# EAGLE design ARE_adaptadora_PIC_8-14pin (EAGLE 6.5.0)
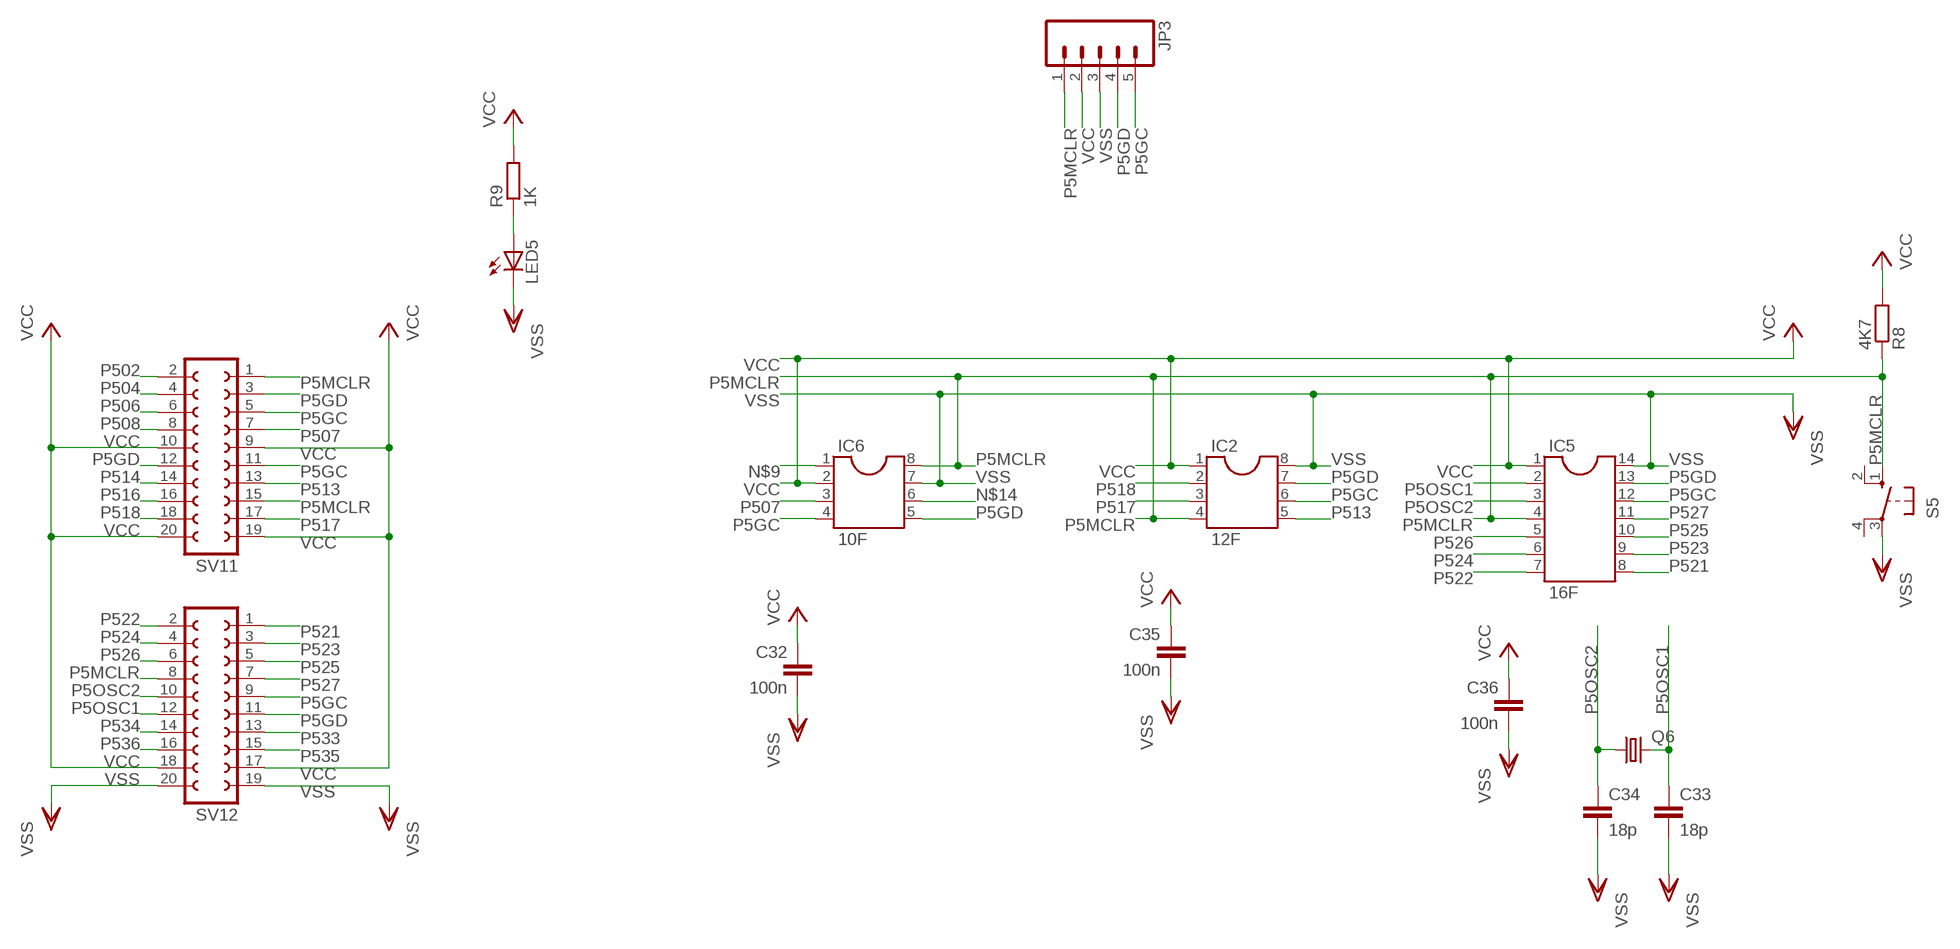
[diagram p0: schematic, sheet 1]

## Parts
C32  100n  C-EUC0805  [C0805]
C33  18p  C-EUC0805  [C0805]
C34  18p  C-EUC0805  [C0805]
C35  100n  C-EUC0805  [C0805]
C36  100n  C-EUC0805  [C0805]
IC2  12F  DIL8S  [SOCKET-08]
IC5  16F  DIL14S  [SOCKET-14]
IC6  10F  DIL8S  [SOCKET-08]
JP3  M05PTH  [1X05]
LED5  LEDCHIPLED_0805  [CHIPLED_0805]
Q6  CRYSTALHC18U-V  [HC18U-V]
R8  4K7  R-EU_R0805  [R0805]
R9  1K  R-EU_R0805  [R0805]
S5  10-XX  [B3F-10XX]
SV11  FE10-2W  [FE10-2W]
SV12  FE10-2W  [FE10-2W]

## Nets
N$8: LED5.A R9.1
N$9: IC6.1
N$14: IC6.6
P5GC: IC2.6 IC5.12 IC6.4 JP3.5 SV11.5 SV11.11 SV12.9
P5GD: IC2.7 IC5.13 IC6.5 JP3.4 SV11.3 SV11.12 SV12.11
P5MCLR: IC2.4 IC5.4 IC6.8 JP3.1 R8.1 S5.1(S) SV11.1 SV11.15 SV12.8
P5OSC1: C33.1 IC5.2 Q6.2 SV12.12
P5OSC2: C34.1 IC5.3 Q6.1 SV12.10
P502: SV11.2
P504: SV11.4
P506: SV11.6
P507: IC6.3 SV11.7
P508: SV11.8
P513: IC2.5 SV11.13
P514: SV11.14
P516: SV11.16
P517: IC2.3 SV11.17
P518: IC2.2 SV11.18
P521: IC5.8 SV12.1
P522: IC5.7 SV12.2
P523: IC5.9 SV12.3
P524: IC5.6 SV12.4
P525: IC5.10 SV12.5
P526: IC5.5 SV12.6
P527: IC5.11 SV12.7
P533: SV12.13
P534: SV12.14
P535: SV12.15
P536: SV12.16
VCC: C32.1 C35.1 C36.1 IC2.1 IC5.1 IC6.2 JP3.2 R8.2 R9.2 SV11.9 SV11.10 SV11.19 SV11.20 SV12.17 SV12.18
VSS: C32.2 C33.2 C34.2 C35.2 C36.2 IC2.8 IC5.14 IC6.7 JP3.3 LED5.C S5.3(P) SV12.19 SV12.20
Unconnected: S5.2(S1) S5.4(P1)

## Library data of the parts
C32-C36 = rcl:C-EU: CAPACITOR, European symbol
IC2 IC6 = ic-package:DIL8: Dual In Line / Socket
IC5 = ic-package:DIL14: Dual In Line / Socket
JP3 = SparkFun:M05: Header 5 Standard 5-pin 0.1" header. Use with straight break away headers (SKU : PRT-00116), right angle break away headers (PRT-00553), swiss pins (PRT-00743), machine pins (PRT-00117), and female headers (PRT-00115). Molex polarized connector foot print use with SKU : PRT-08230 with associated crimp pins and housings.
LED5 = led:LED: LED OSRAM: - CHIPLED LG R971, LG N971, LY N971, LG Q971, LY Q971, LO R971, LY R971 LH N974, LH R974 LS Q976, LO Q976, LY Q976 LO Q996 - Hyper CHIPLED LW Q18S LB Q993, LB Q99A, LB R99A - SideLED LS A670, LO A670, LY A670, LG A670, LP A670 LB A673, LV A673, LT A673, LW A673 LH A674 LY A675 LS A676, LA A676, LO A676, LY A676, LW A676 LS A679, LY A679, LG A679 - Hyper Micro SIDELED® LS Y876, LA Y876, LO Y876, LY Y876 LT Y87S - SmartLED LW L88C, LW L88S LB L89C, LB L89S, LG L890 LS L89K, LO L89K, LY L89K LS L896, LA L896, LO L896, LY L896 - TOPLED LS T670, LO T670, LY T670, LG T670, LP T670 LSG T670, LSP T670, LSY T670, LOP T670, LYG T670 LG T671, LOG T671, LSG T671 LB T673, LV T673, LT T673, LW T673 LH T674 LS T676, LA T676, LO T676, LY T676, LB T676, LH T676, LSB T676, LW T676 LB T67C, LV T67C, LT T67C, LS T67K, LO T67K, LY T67K, LW E67C LS E67B, LA E67B, LO E67B, LY E67B, LB E67C, LV E67C, LT E67C LW T67C LS T679, LY T679, LG T679 LS T770, LO T770, LY T770, LG T770, LP T770 LB T773, LV T773, LT T773, LW T773 LH T774 LS E675, LA E675, LY E675, LS T675 LS T776, LA T776, LO T776, LY T776, LB T776 LHGB T686 LT T68C, LB T68C - Hyper Mini TOPLED® LB M676 - Mini TOPLED Santana® LG M470 LS M47K, LO M47K, LY M47K Source: http://www.osram.convergy.de LUXEON: - LUMILED® LXK2-PW12-R00, LXK2-PW12-S00, LXK2-PW14-U00, LXK2-PW14-V00 LXK2-PM12-R00, LXK2-PM12-S00, LXK2-PM14-U00 LXK2-PE12-Q00, LXK2-PE12-R00, LXK2-PE12-S00, LXK2-PE14-T00, LXK2-PE14-U00 LXK2-PB12-K00, LXK2-PB12-L00, LXK2-PB12-M00, LXK2-PB14-N00, LXK2-PB14-P00, LXK2-PB14-Q00 LXK2-PR12-L00, LXK2-PR12-M00, LXK2-PR14-Q00, LXK2-PR14-R00 LXK2-PD12-Q00, LXK2-PD12-R00, LXK2-PD12-S00 LXK2-PH12-R00, LXK2-PH12-S00 LXK2-PL12-P00, LXK2-PL12-Q00, LXK2-PL12-R00 Source: www.luxeon.com KINGBRIGHT: KA-3528ASYC Source: www.kingbright.com
Q6 = crystal:CRYSTAL: CRYSTAL; OC_FARNELL: unknown; OC_NEWARK: unknown
R8 R9 = rcl:R-EU_: RESISTOR, European symbol
S5 = switch-omron:10-XX: OMRON SWITCH; MPN: B3F-1000; OC_FARNELL: 176432; OC_NEWARK: 36M3542
SV11 SV12 = con-lsta:FE10-2W: FEMALE HEADER; OC_FARNELL: unknown; OC_NEWARK: unknown

## Board
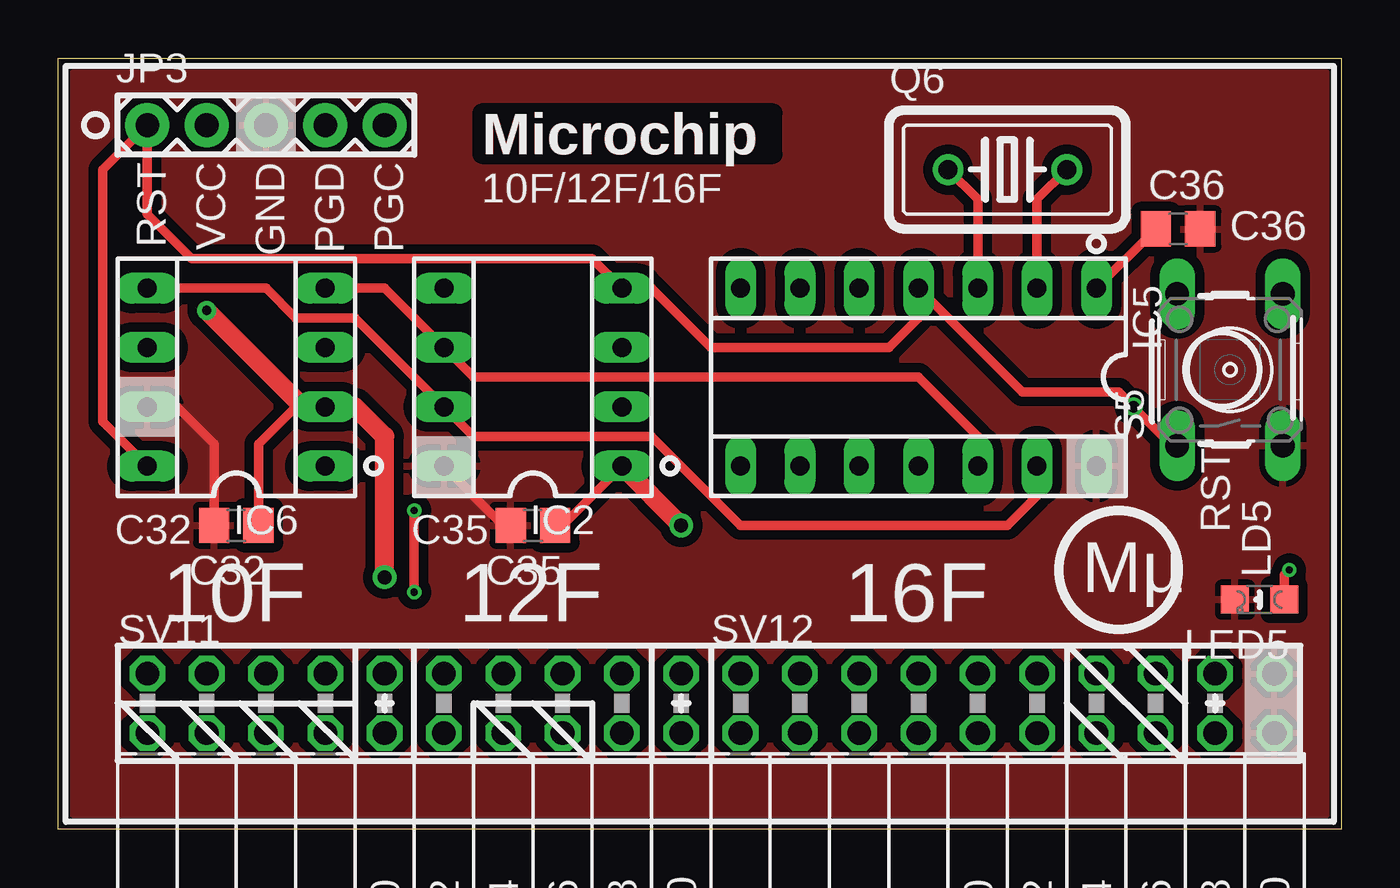
[diagram p1: board, top side]
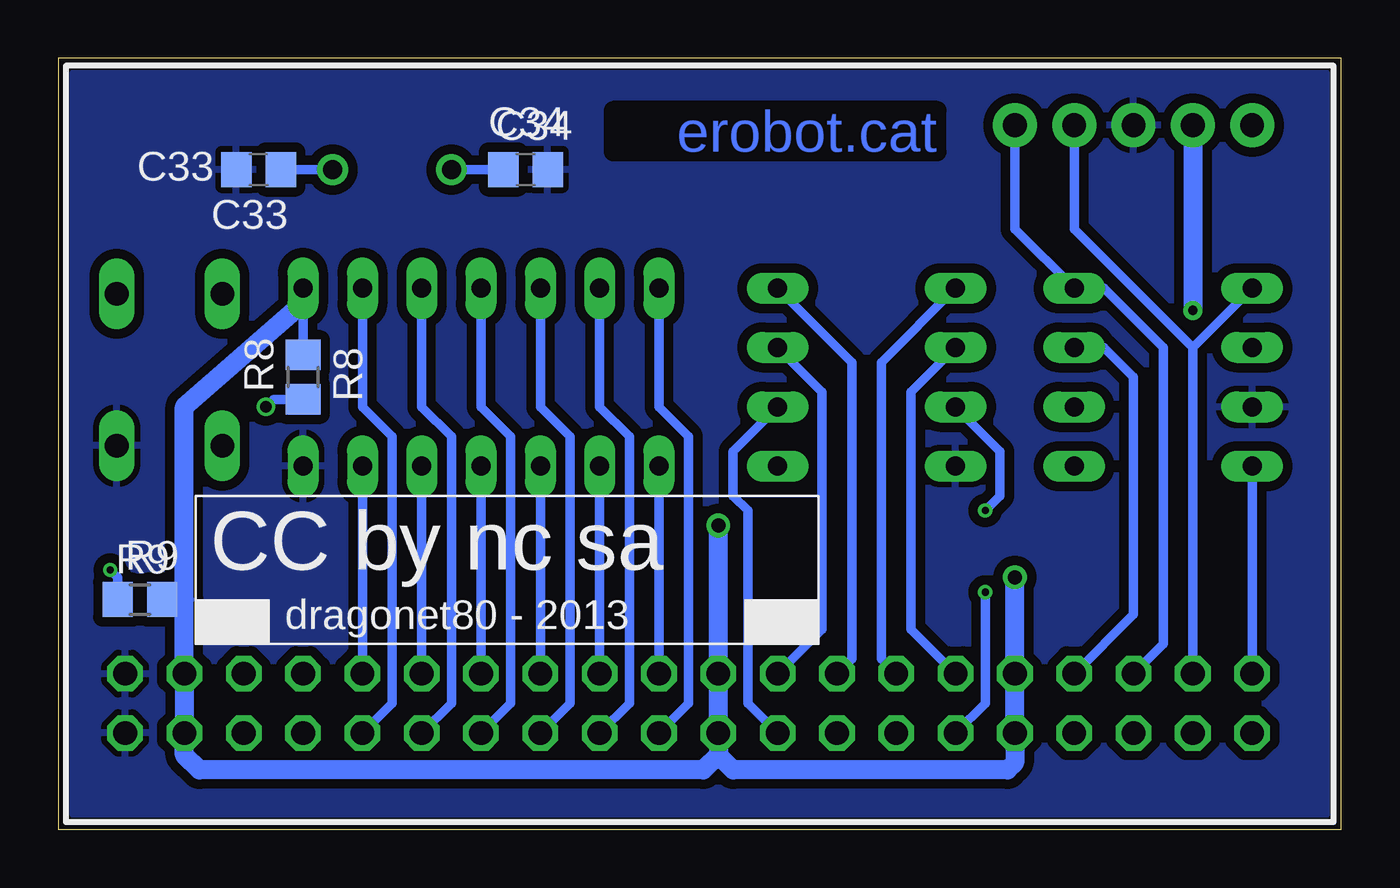
[diagram p2: board, bottom side, seen from below]

Size 54.93 x 33.02 mm. Coordinates in mm from the lower left corner, seen from the top.
Outline: 54.93,0 0,0 0,33.02 54.93,33.02 54.93,0
Copper layers (1*16): Top 0.035mm / dielectric 1.5mm / Bottom 0.035mm
Design rules "ITEADstudio_DRC": minimum track width 6mil, minimum drill 12mil, track to track 6mil, track to pad 6mil, pad to pad 6mil, via to via 6mil, smd to smd 0mil, copper to edge 10mil, drill to drill 10mil, minimum pad ring 10mil, minimum via ring 6mil, stop-mask expansion 2mil, vias tented up to drill 100mil, thermal gap 10mil

### Footprints (pad centres in the part's own frame; a part is rotated, then mirrored left to right if it is on the bottom)
C0805 = smd 1.3 x 1.5: 1 -0.95,0; 2 0.95,0
SOCKET-08 = drill 0.813 long: 1 -3.81,-3.81; 2 -1.27,-3.81; 3 1.27,-3.81; 4 3.81,-3.81; 5 3.81,3.81; 6 1.27,3.81; 7 -1.27,3.81; 8 -3.81,3.81
SOCKET-14 = drill 0.813 long: 1 -7.62,-3.81; 2 -5.08,-3.81; 3 -2.54,-3.81; 4 0,-3.81; 5 2.54,-3.81; 6 5.08,-3.81; 7 7.62,-3.81; 8 7.62,3.81; 9 5.08,3.81; 10 2.54,3.81; 11 0,3.81; 12 -2.54,3.81; 13 -5.08,3.81; 14 -7.62,3.81
1X05 = drill 1.016 pad 1.88: 1 0,0; 2 2.54,0; 3 5.08,0; 4 7.62,0; 5 10.16,0
CHIPLED_0805 = smd 1.2 x 1.2: A 0,-1.05; C 0,1.05
HC18U-V = drill 0.813: 1 -2.54,0; 2 2.54,0
R0805 = smd 1.3 x 1.5: 1 -0.95,0; 2 0.95,0
B3F-10XX = drill 1.016 long: 1 -3.251,2.261; 2 3.251,2.261; 3 -3.251,-2.261; 4 3.251,-2.261
FE10-2W = drill 1.016 octagon: 1 -11.43,1.27; 2 -11.43,-1.27; 3 -8.89,1.27; 4 -8.89,-1.27; 5 -6.35,1.27; 6 -6.35,-1.27; 7 -3.81,1.27; 8 -3.81,-1.27; 9 -1.27,1.27; 10 -1.27,-1.27; 11 1.27,1.27; 12 1.27,-1.27; 13 3.81,1.27; 14 3.81,-1.27; 15 6.35,1.27; 16 6.35,-1.27; 17 8.89,1.27; 18 8.89,-1.27; 19 11.43,1.27; 20 11.43,-1.27

### Placement (x,y rotation side)
C32  7.62,13.02 180 top
C33  46.36,28.26 180 bottom
C34  34.92,28.26 0 bottom
C35  20.32,13.02 180 top
C36  47.94,25.72 0 top
IC2  20.32,19.37 90 top
IC5  36.83,19.37 180 top
IC6  7.62,19.37 90 top
JP3  3.81,30.16 0 top
LED5  51.44,9.84 90 top
Q6  40.64,28.26 0 top
R8  44.45,19.37 90 bottom
R9  51.44,9.84 0 bottom
S5  50.16,19.68 90 top
SV11  15.24,5.4 0 top
SV12  40.64,5.4 0 top

### Tracks (layer width: path | path; a pad name or v marks a point on that pad's centre or on a via)
N$8  (via drill 0.3 pad 0.61)
  Top 0.406: LED5.A 52.48,10.89 v52.7,11.11
  Bottom 0.406: R9.1 52.38,10.79 v52.7,11.11
P5GC
  Top 0.406: IC6.4 13.97,23.18 IC2.6 17.78,19.37 36.83,19.37 39.37,16.83 IC5.12
  Bottom 0.406: SV11.5 7.62,7.94 7.62,20.64 10.16,23.18 IC6.4 13.97,25.72 JP3.5 | IC2.6 18.41,18.73 18.41,8.57 SV11.11 | IC5.12 SV12.9
P5GD  (via drill 0.3 pad 0.61)
  Top 0.406: v15.24,13.65 v15.24,10.16 | IC5.13 41.91,14.29 40.64,13.02 29.21,13.02 25.4,16.83 17.78,16.83 IC2.7 12.7,21.91 10.16,21.91 8.89,23.18 IC6.5
  Bottom 0.406: SV11.3 6.35,20.64 | 6.35,20.64 IC6.5 | IC2.7 14.6,16.19 14.6,14.29 v15.24,13.65 | v15.24,10.16 15.24,5.4 SV11.12 | SV12.11 IC5.13 | JP3.4 11.43,25.72 6.35,20.64
P5MCLR  (via drill 0.5 pad 0.61)
  Top 0.406: IC6.8 1.9,17.46 1.9,28.26 JP3.1 3.81,26.35 5.71,24.45 22.86,24.45 IC2.4 25.4,23.18 27.94,20.64 35.56,20.64 36.83,21.91 IC5.4 41.27,18.73 45.4,18.73 v46.04,18.1 47.62,16.51 47.59,16.47 47.62,16.43 S5.1
  Bottom 0.406: IC6.8 SV11.1 | IC2.4 20.95,20 20.95,7.3 SV11.15 | SV12.8 35.56,5.4 35.56,16.83 36.83,18.1 IC5.4 | R8.1 45.72,18.42 v46.04,18.1
P5OSC1
  Top 0.406: IC5.2 41.91,26.99 Q6.2
  Bottom 0.406: C33.1 Q6.2 | SV12.12 40.64,5.4 40.64,16.83 41.91,18.1 IC5.2
P5OSC2
  Top 0.406: IC5.3 39.37,26.99 Q6.1
  Bottom 0.406: C34.1 Q6.1 | SV12.10 38.1,5.4 38.1,16.83 39.37,18.1 IC5.3
P507
  Bottom 0.406: IC6.3 10.16,20.64 8.89,19.37 8.89,9.21 SV11.7
P513
  Bottom 0.406: IC2.5 19.69,20 19.69,7.3 SV11.13
P517
  Bottom 0.406: IC2.3 22.22,18.73 22.22,8.57 SV11.17
P518
  Bottom 0.406: IC2.2 26.03,16.19 26.03,14.29 25.4,13.65 25.4,5.4 SV11.18
P521
  Bottom 0.406: IC5.8 SV12.1
P522
  Bottom 0.406: IC5.7 29.21,18.1 27.94,16.83 27.94,5.4 SV12.2
P523
  Bottom 0.406: IC5.9 SV12.3
P524
  Bottom 0.406: IC5.6 31.75,18.1 30.48,16.83 30.48,5.4 SV12.4
P525
  Bottom 0.406: IC5.10 SV12.5
P526
  Bottom 0.406: IC5.5 34.29,18.1 33.02,16.83 33.02,5.4 SV12.6
P527
  Bottom 0.406: IC5.11 SV12.7
VCC  (via drill 0.41 pad 0.81, 0.6 pad 1.02)
  Top 0.406: C35.1 21.59,13.02 IC2.1 | C32.1 8.57,16.51 10.16,18.1 10.48,18.1 | C36.1 IC5.1
  Top 0.813: v13.97,10.79 13.97,16.83 12.7,18.1 IC6.2 10.48,18.1 v6.35,22.23 | v26.67,13.02 IC2.1
  Bottom 0.406: R8.2 IC5.1 | R9.2 49.53,9.84
  Bottom 0.813: v13.97,10.79 SV11.9 SV11.10 13.97,2.86 14.29,2.54 26.03,2.54 26.67,3.17 | v26.67,13.02 SV11.19 SV11.20 26.67,3.17 | IC5.1 44.45,22.54 49.53,18.1 49.53,9.84 SV12.17 SV12.18 49.53,3.17 48.89,2.54 27.3,2.54 26.67,3.17 | JP3.2 v6.35,22.23
VSS
  Top 0.406: C35.2 19.05,13.02 IC2.8 | C32.2 6.67,16.51 5.08,18.1 IC6.7
  pour Bottom (isolate 0.406): 0.63,0.64 54.29,0.64 54.29,32.38 0.63,32.38
  pour Top (isolate 0.406): 0.63,0.64 54.29,0.64 54.29,32.38 0.63,32.38

### Text on the board
Top: Microchip
Bottom: erobot.cat
_tsilk: RST | VCC | GND | PGD | PGC | Microchip | 10F/12F/16F | C36 | RST | C32 | C35 | LD5 | Mµ | 10F | 12F | 16F
_bsilk: C34 | C33 | R8 | R9 | CC by nc sa | dragonet80 - 2013